# EAGLE design TG16_RF_DIN (EAGLE 9.6.2)
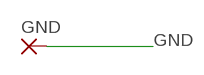
[diagram p0: schematic, sheet 1]

## Parts
GND  SMD5  [SMD2,54-5,08]

## Nets
GND: GND.1(P)

## Library data of the parts
GND = wirepad:SMD5: SMD PAD

## Board
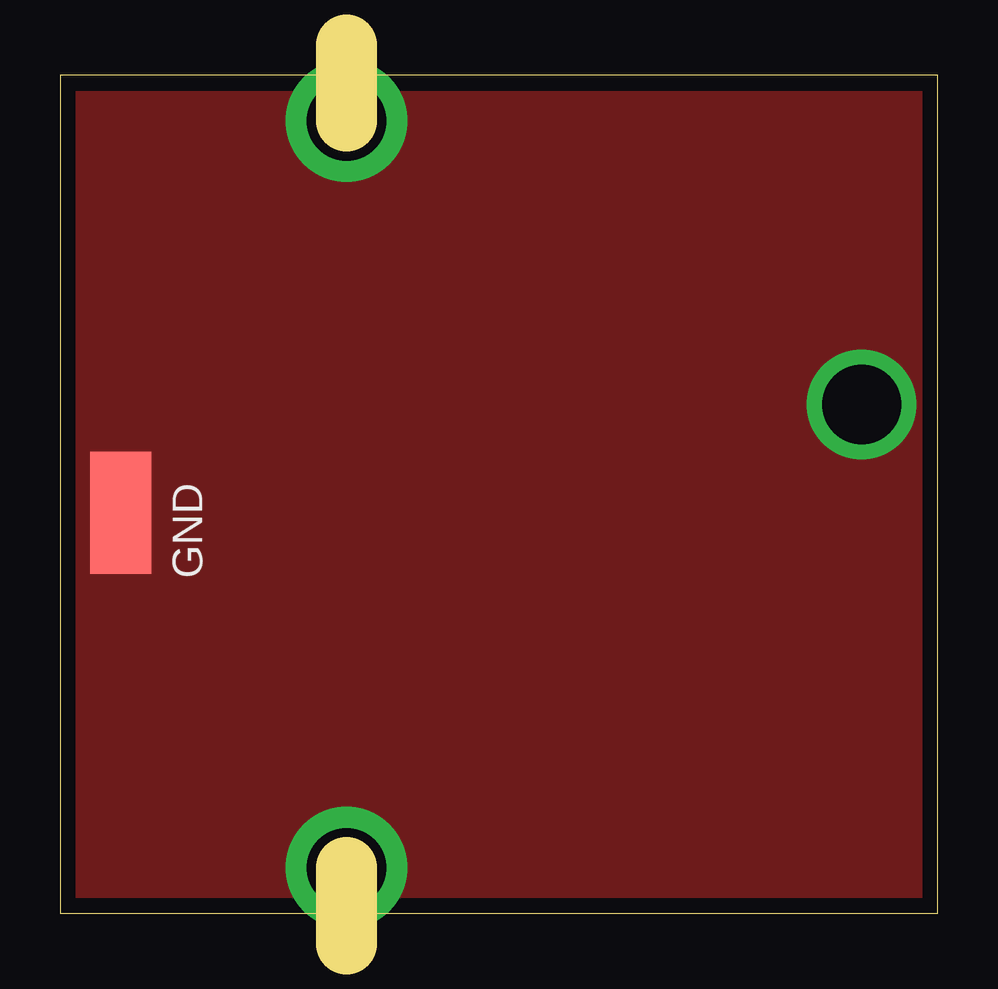
[diagram p1: board, top side]
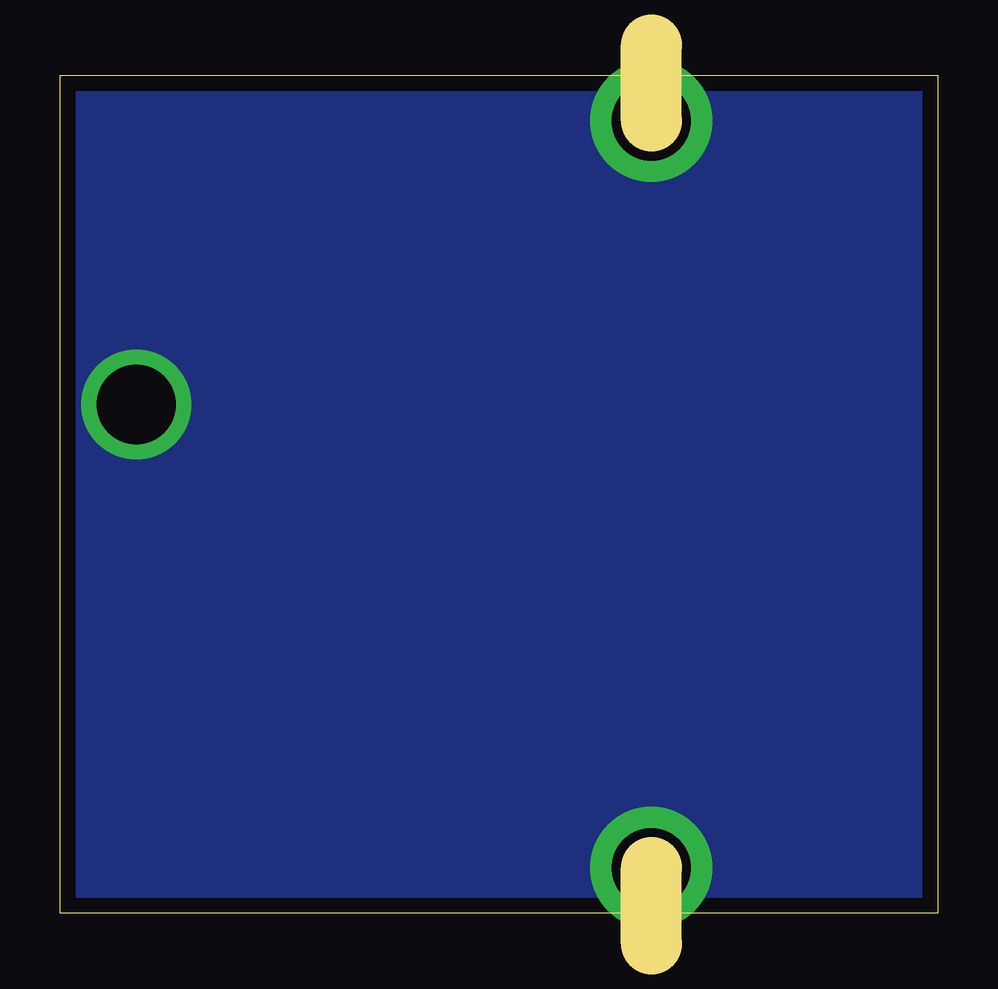
[diagram p2: board, bottom side, seen from below]

Size 36.58 x 34.92 mm. Coordinates in mm from the lower left corner, seen from the top.
Outline: 0,0 36.58,0 36.58,34.92 0,34.92 0,0
Copper layers (1*16): Top 0.035mm / dielectric 1.5mm / Bottom 0.035mm
Design rules "default *": minimum track width 6mil, minimum drill 0.35mm, track to track 6mil, track to pad 6mil, pad to pad 6mil, via to via 6mil, smd to smd 6mil, copper to edge 25mil, drill to drill 6mil, minimum pad ring 10mil, minimum via ring 8mil, stop-mask expansion 4mil, vias tented up to drill 0mil, thermal gap 10mil
Milling: 2 lines

### Footprints (pad centres in the part's own frame; a part is rotated, then mirrored left to right if it is on the bottom)
SMD2,54-5,08 = smd 2.54 x 5.08: 1 0,0

### Placement (x,y rotation side)
GND  2.54,16.7 0 top

### Tracks (layer width: path | path; a pad name or v marks a point on that pad's centre or on a via)
GND  (via drill 3.3 pad 4.57, 3.3 pad 5.08)
  other vias: 33.4,21.21 11.94,33.02 11.94,1.91
  pour Top (no thermals): 0.64,34.29 0.64,0.64 38.1,0.64 38.1,34.29
  pour Bottom (no thermals): 37.47,34.29 37.47,0.64 0.64,0.64 0.64,34.29

### Text on the board
Reference: Front